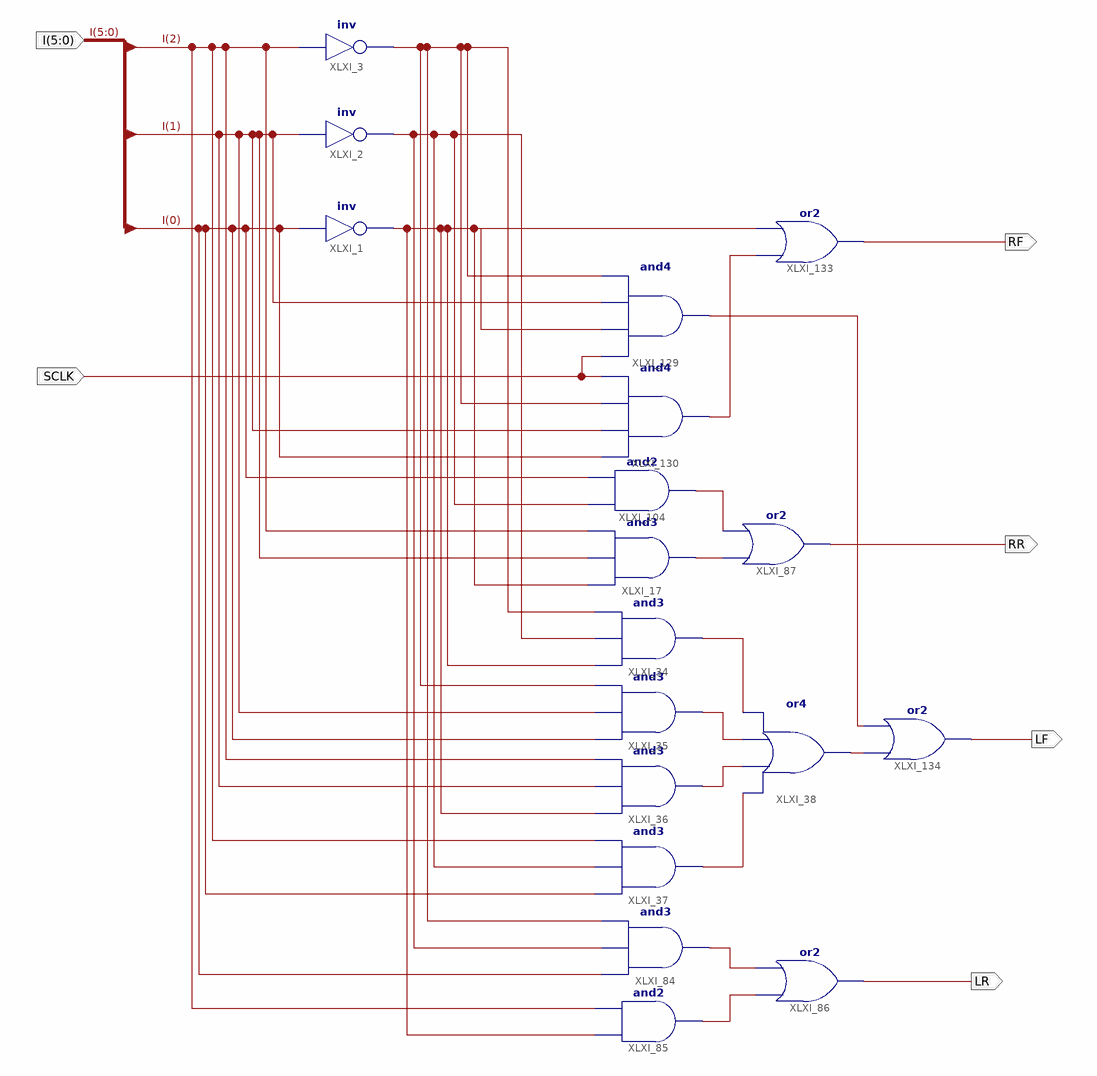
[diagram p0: schematic sheet 1]
// Xilinx ISE schematic Decoder.sch (xc9500xl) as structural Verilog: 18 symbols, 6 ports
module Decoder (
  input  [5:0] I,
  input  SCLK,
  output LR,
  output RR,
  output LF,
  output RF
);

  wire BR1, XLXN_39, XLXN_42, XLXN_61, XLXN_62, XLXN_63, XLXN_64, XLXN_163, XLXN_164, XLXN_166, XLXN_286,
       XLXN_295, XLXN_306, XLXN_307;

  not XLXI_2 (XLXN_166, I[1]);
  not XLXI_3 (XLXN_295, I[2]);
  not XLXI_1 (BR1, I[0]);
  and XLXI_85 (XLXN_164, BR1, I[2]);
  and XLXI_84 (XLXN_163, I[0], XLXN_166, XLXN_295);
  or XLXI_86 (LR, XLXN_164, XLXN_163);
  or XLXI_38 (XLXN_286, XLXN_64, XLXN_63, XLXN_62, XLXN_61);
  and XLXI_37 (XLXN_64, I[0], XLXN_166, I[2]);
  and XLXI_36 (XLXN_63, BR1, I[1], I[2]);
  and XLXI_35 (XLXN_62, I[0], I[1], XLXN_295);
  and XLXI_34 (XLXN_61, BR1, XLXN_166, XLXN_295);
  and XLXI_17 (XLXN_39, BR1, I[1], I[2]);
  or XLXI_87 (RR, XLXN_39, XLXN_42);
  and XLXI_104 (XLXN_42, XLXN_166, I[0]);
  and XLXI_129 (XLXN_307, SCLK, BR1, I[1], XLXN_295);
  and XLXI_130 (XLXN_306, I[0], I[1], XLXN_295, SCLK);
  or XLXI_133 (RF, XLXN_306, BR1);
  or XLXI_134 (LF, XLXN_286, XLXN_307);
endmodule
